# Altium schematic sheet Magnetometer.SchDoc
size A4; SheetNumber: 7; SheetTotal: 8
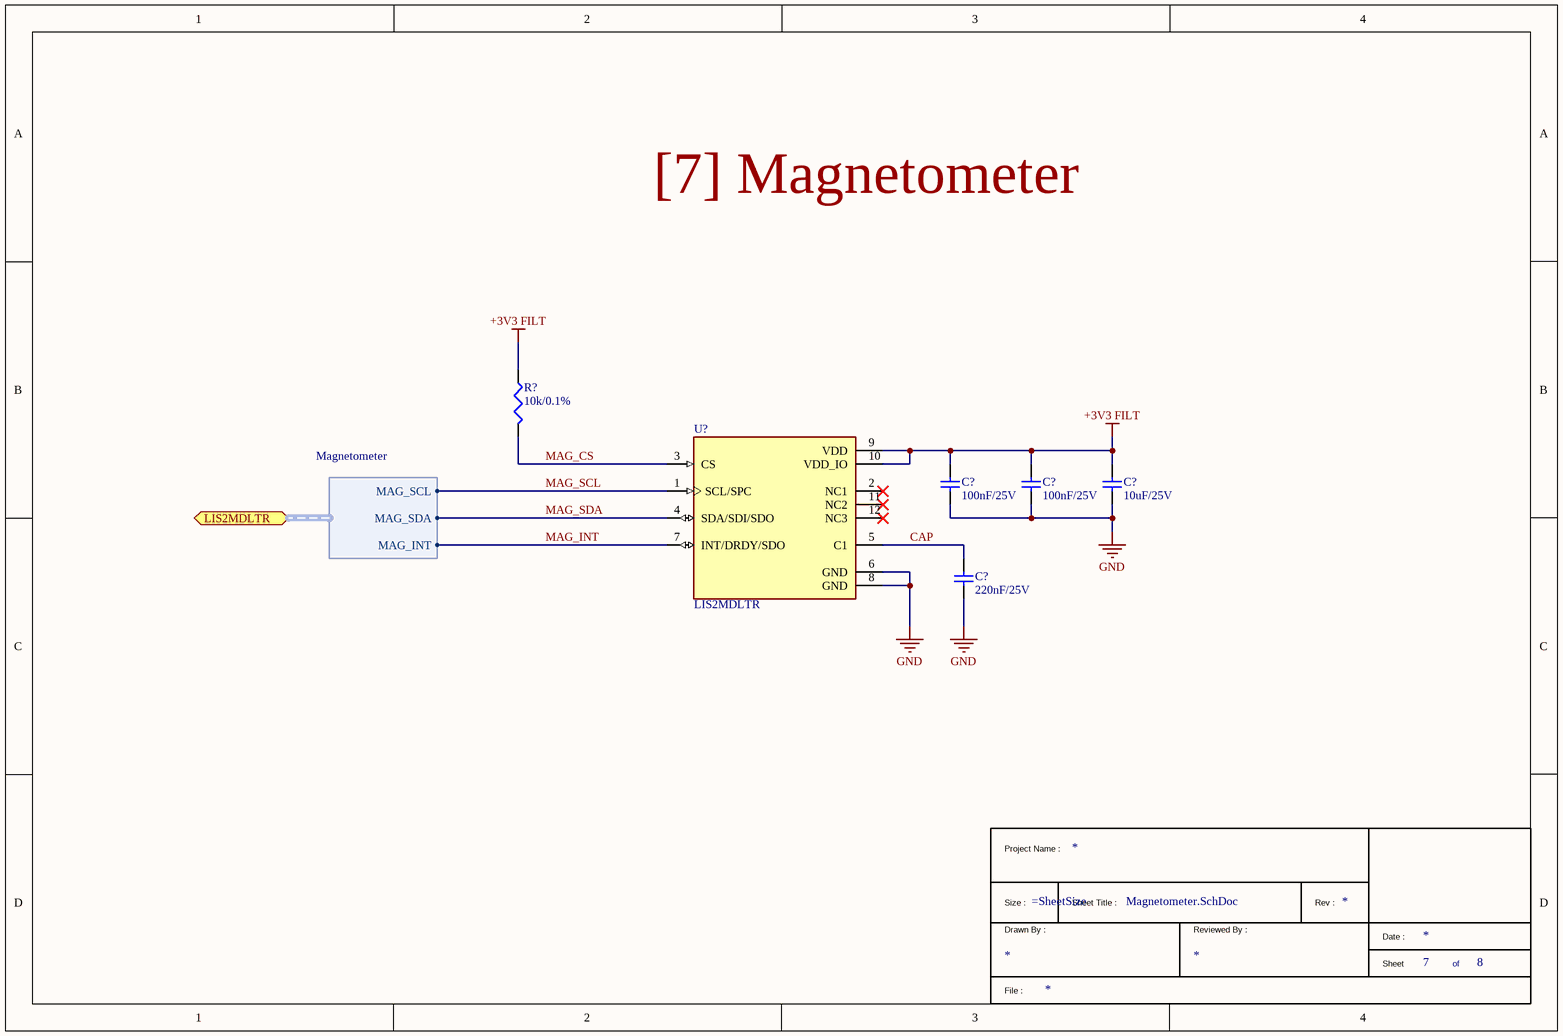
[diagram p0: Magnetometer.SchDoc]

## Parts
(Parts that share a designator on the sheet are numbered #1, #2 ... from top to bottom, then left to right.)
*  TitleBlock1  (value not drawn)  (graphical)
C?#1  100nF/25V  [CAP_0402]
C?#2  100nF/25V  [CAP_0402]
C?#3  10uF/25V  [CAP_1206]
C?#4  220nF/25V  [CAP_0402]
R?  10k/0.1%  [RES_0402]
U?  LIS2MDLTR  [LIS2MDLTR_LGA-12(2x2)]

## Ports
LIS2MDLTR (bidir, harness Magnetometer)

## Harnesses
Magnetometer: MAG_SCL, MAG_SDA, MAG_INT

## Nets
+3V3 FILT: C?#1.2 C?#2.2 C?#3.2 R?.1 U?.9(VDD) U?.10(VDD_IO)
GND: C?#1.1 C?#2.1 C?#3.1 C?#4.1 U?.6(GND) U?.8(GND)
CAP: C?#4.2 U?.5(C1)
MAG_CS: R?.2 U?.3(CS)
MAG_INT: U?.7(INT/DRDY/SDO) ; port LIS2MDLTR.MAG_INT
MAG_SCL: U?.1(SCL/SPC) ; port LIS2MDLTR.MAG_SCL
MAG_SDA: U?.4(SDA/SDI/SDO) ; port LIS2MDLTR.MAG_SDA

Not connected (* = marked no-connect by the designer): U? 2(NC1)* 11(NC2)* 12(NC3)*

## Notes on the sheet
- [7] Magnetometer
- (in symbol TitleBlock1) Project Name :; Size :; Sheet Title :; Rev :; Drawn By :; Reviewed By :; Date :; Sheet; of; File :

## Library data of the parts
C?#1 C?#2 = YAGEO CC0402JRX7R8BB104: 100nF ±5% 25V Ceramic Capacitor X7R 0402; Manufacturer: YAGEO; Manufacturer Part Number: CC0402JRX7R8BB104; LCSC Part Number: C541465; Package: 0402; Mounting Type: SMD; ComponentLink2Description: Digikey Link; ComponentLink3Description: LCSC Link; ComponentLink3URL: https://www.lcsc.com/product-detail/C541465.html?spm=wm.fly.bg.0.xh___wm.fly.dhl.mly.12-0-4&lcsc_vid=QlAIX1RQQQJfX1VRTwcNAQJXTlRaUQBVEQBYAwJfFFcxVlNRQFhYU1xWRFVdXztW
C?#3 = muRata GRM31CR71E106KA12L: 10uF ±10% 25V Ceramic Capacitor X7R 1206; Manufacturer: muRata; Manufacturer Part Number: GRM31CR71E106KA12L; LCSC Part Number: C77093; Package: 1206; Mounting Type: SMD; ComponentLink2Description: Digikey Link; ComponentLink3Description: LCSC Link; ComponentLink3URL: https://www.lcsc.com/product-detail/C77093.html?spm=wm.fly.bg.1.xh___wm.sxq.dhl.mly.12-0-4&lcsc_vid=QlAIX1RQQQJfX1VRTwcNAQJXTlRaUQBVEQBYAwJfFFcxVlNRT1FaUl1VQVZcUDsOAxUeFF5JWBYZEEoKFBINSQcJGk4%3D
C?#4 = YAGEO CC0402KRX7R8BB224: 220nF ±10% 25V Ceramic Capacitor X7R 0402; Manufacturer: YAGEO; Manufacturer Part Number: CC0402KRX7R8BB224; LCSC Part Number: C723566; Package: 0402; Mounting Type: SMD; ComponentLink2Description: Digikey Link; ComponentLink3Description: LCSC Link; ComponentLink3URL: https://www.lcsc.com/product-detail/C723566.html?spm=wm.fly.bg.0.xh___wm.sy.dhl.mly.12-0-4&lcsc_vid=QlAIX1RQQQJfX1VRTwcNAQJXTlRaUQBVEQBYAwJfFFcxVlNRT1BcUFBQTlRYVTtW
R? = YAGEO RT0402BRD0710KL: 62.5mW 10kΩ 50V Thin Film Resistor ±25ppm/℃ ±0.1% 0402 Chip Resistor - Surface Mount RoHS; Manufacturer: YAGEO; Manufacturer Part Number: RT0402BRD0710KL; LCSC Part Number: C190095; Package: 0402; ComponentLink1Description: Digikey Link; Mounting Type: SMD; ComponentLink2Description: LCSC Link; ComponentLink2URL: https://www.lcsc.com/product-detail/C190095.html?spm=wm.fly.bg.0.xh___wm.fly.dhl.mly.12-6-1&lcsc_vid=QlAIX1RQQQJfX1VRTwcNAQJXTlRaUQBVEQBYAwJfFFcxVlNRT1FbV1FfR1JZUDsOAxUeFF5JWBYZEEoKFBINSQcJGk4dAgUUFAk%3D
U? = ST LIS2MDLTR: Digital output magnetic sensor: ultra-low-power, high-performance 3-axis magnetometer; Manufacturer: ST; Manufacturer Part Number: LIS2MDLTR; LCSC Part Number: C919695; Package: LGA-12(2x2); Mounting Type: SMD; ComponentLink2Description: Digikey Link; ComponentLink3Description: LCSC Link; ComponentLink3URL: https://www.lcsc.com/product-detail/C919695.html?s_z=n_q_C919695